# EAGLE design GCDuino3v3 (EAGLE 6.3)
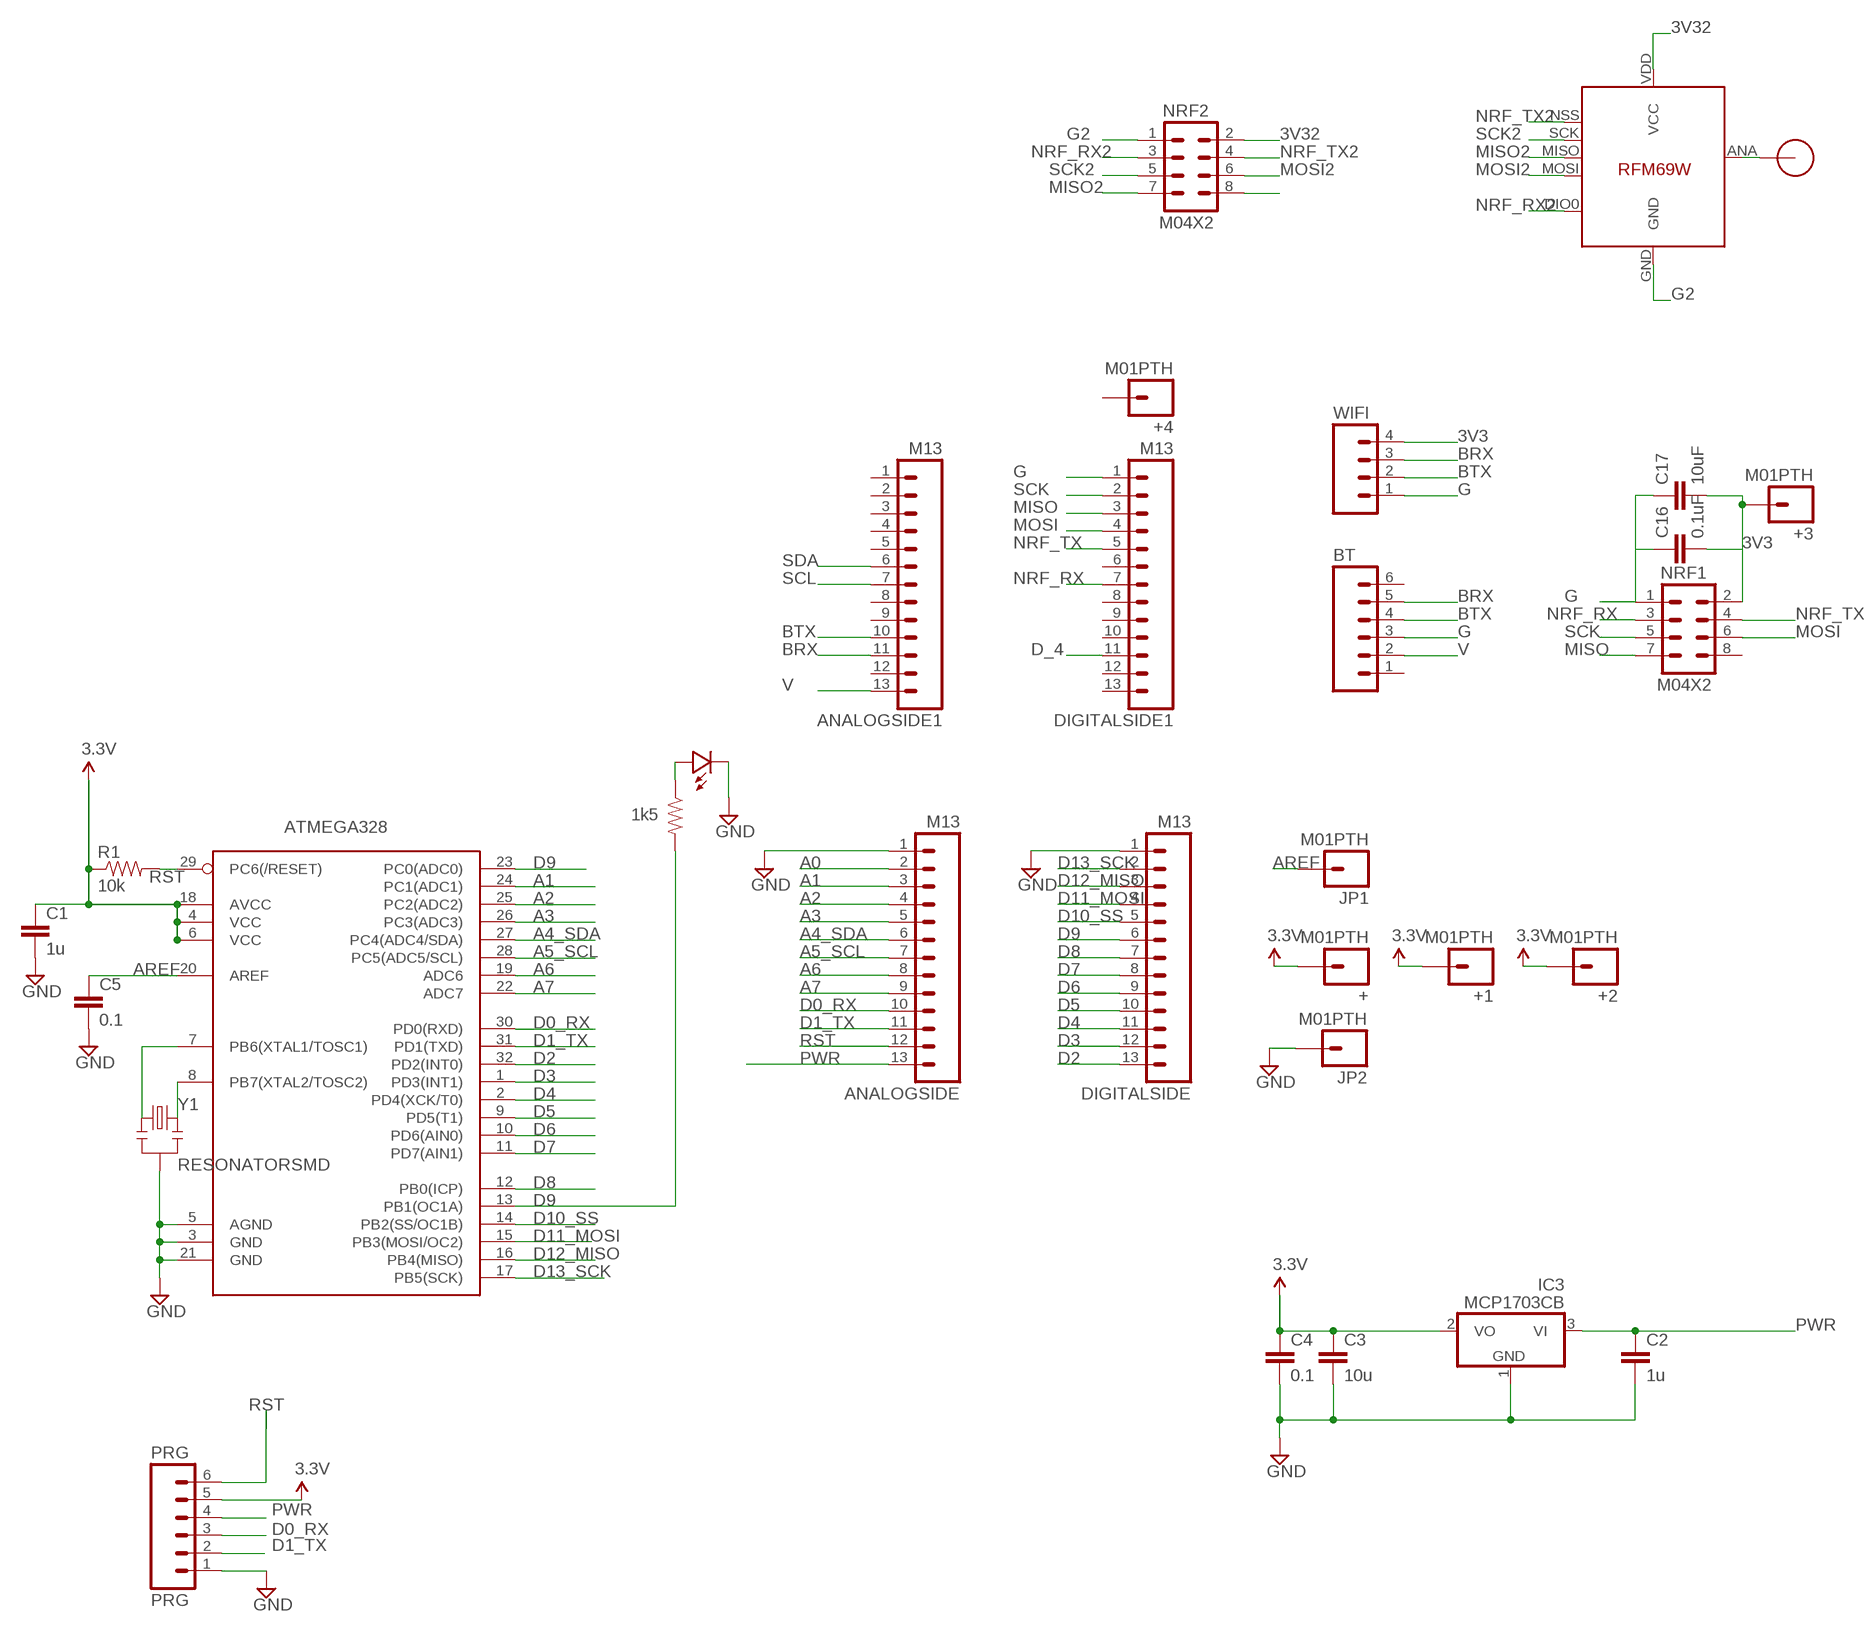
[diagram p0: schematic, sheet 1]

## Parts
+  M01PTH  [1X01]
+1  M01PTH  [1X01]
+2  M01PTH  [1X01]
+3  M01PTH  [1X01]
+4  M01PTH  [1X01]
ANALOGSIDE  M13  [1X13]
ANALOGSIDE1  M13  [1X13]
ATMEGA328  ATMega-328  ATMEGA168/328TQFP32  [TQFP32-08]
BT  M06SIP  [1X06]
C1  1u  CAP0805  [0805]
C2  1u  CAP0805  [0805]
C3  10u  CAP0805-CAP  [0805-CAP]
C4  0.1  CAP0805  [0805]
C5  0.1  CAP0805  [0805]
C16  0.1uF  CAP0805  [0805]
C17  10uF  CAP0805  [0805]
DIGITALSIDE  M13  [1X13]
DIGITALSIDE1  M13  [1X13]
IC3  MCP1703CB  [SOT23]
JP1  M01PTH  [1X01]
JP2  M01PTH  [1X01]
NRF1  M04X2  [2X4]
NRF2  M04X2  [2X4]
PRG  PRG  M06SIP  [1X06]
R1  10k  RESISTOR0805  [0805]
R2  1k5  RESISTOR0805  [0805]
U$2  LED0805  [0805-LED]
U$5  RFM69  [RFM69W-MINPADS]
U$8  RFM12B_ANTENNA  [RFM12B-ANTENNA]
WIFI  M04PTH  [1X04]
Y1  RESONATORSMD  [RESONATOR-SMD]

## Nets
3.3V: +1.1 +2.1 +.1 ATMEGA328.4(VCC) ATMEGA328.6(VCC) ATMEGA328.18(AVCC) C1.1 C3.1 C4.1 IC3.2(VO) PRG.5 R1.1
3V3: +3.1 C16.2 C17.2 NRF1.2 WIFI.4
3V32: NRF2.2 U$5.VDD(VCC)
A0: ANALOGSIDE.2 ATMEGA328.23(PC0(ADC0))
A1: ANALOGSIDE.3 ATMEGA328.24(PC1(ADC1))
A2: ANALOGSIDE.4 ATMEGA328.25(PC2(ADC2))
A3: ANALOGSIDE.5 ATMEGA328.26(PC3(ADC3))
A4_SDA: ANALOGSIDE.6 ATMEGA328.27(PC4(ADC4/SDA))
A5_SCL: ANALOGSIDE.7 ATMEGA328.28(PC5(ADC5/SCL))
A6: ANALOGSIDE.8 ATMEGA328.19(ADC6)
A7: ANALOGSIDE.9 ATMEGA328.22(ADC7)
AREF: ATMEGA328.20(AREF) C5.1 JP1.1
BRX: ANALOGSIDE1.11 BT.5 WIFI.3
BTX: ANALOGSIDE1.10 BT.4 WIFI.2
D0_RX: ANALOGSIDE.10 ATMEGA328.30(PD0(RXD)) PRG.3
D1_TX: ANALOGSIDE.11 ATMEGA328.31(PD1(TXD)) PRG.2
D2: ATMEGA328.32(PD2(INT0)) DIGITALSIDE.13
D3: ATMEGA328.1(PD3(INT1)) DIGITALSIDE.12
D4: ATMEGA328.2(PD4(XCK/T0)) DIGITALSIDE.11
D5: ATMEGA328.9(PD5(T1)) DIGITALSIDE.10
D6: ATMEGA328.10(PD6(AIN0)) DIGITALSIDE.9
D7: ATMEGA328.11(PD7(AIN1)) DIGITALSIDE.8
D8: ATMEGA328.12(PB0(ICP)) DIGITALSIDE.7
D9: ATMEGA328.13(PB1(OC1A)) DIGITALSIDE.6 R2.2
D10_SS: ATMEGA328.14(PB2(SS/OC1B)) DIGITALSIDE.5
D11_MOSI: ATMEGA328.15(PB3(MOSI/OC2)) DIGITALSIDE.4
D12_MISO: ATMEGA328.16(PB4(MISO)) DIGITALSIDE.3
D13_SCK: ATMEGA328.17(PB5(SCK)) DIGITALSIDE.2
D_4: DIGITALSIDE1.11
G: BT.3 C16.1 C17.1 DIGITALSIDE1.1 NRF1.1 WIFI.1
G2: NRF2.1 U$5.GND
GND [power]: ANALOGSIDE.1 ATMEGA328.3(GND) ATMEGA328.5(AGND) ATMEGA328.21(GND) C1.2 C2.2 C3.2 C4.2 C5.2 DIGITALSIDE.1 IC3.1(GND) JP2.1 PRG.1 U$2.MINUS Y1.2
MISO: DIGITALSIDE1.3 NRF1.7
MISO2: NRF2.7 U$5.MISO
MOSI: DIGITALSIDE1.4 NRF1.6
MOSI2: NRF2.6 U$5.MOSI
N$1: ATMEGA328.7(PB6(XTAL1/TOSC1)) Y1.1
N$2: R2.1 U$2.PLUS
N$3: U$5.ANA(ANT) U$8.P$1
N$4: NRF2.8
N$21: ATMEGA328.8(PB7(XTAL2/TOSC2)) Y1.3
NRF_RX: DIGITALSIDE1.7 NRF1.3
NRF_RX2: NRF2.3 U$5.DIO0
NRF_TX: DIGITALSIDE1.5 NRF1.4
NRF_TX2: NRF2.4 U$5.NSS(SEL)
PWR [power]: ANALOGSIDE.13 C2.1 IC3.3(VI) PRG.4
RST: ANALOGSIDE.12 ATMEGA328.29(PC6(/RESET)) PRG.6 R1.2
SCK: DIGITALSIDE1.2 NRF1.5
SCK2: NRF2.5 U$5.SCK
SCL: ANALOGSIDE1.7
SDA: ANALOGSIDE1.6
V: ANALOGSIDE1.13 BT.2
Unconnected: +4.1 ANALOGSIDE1.1 ANALOGSIDE1.2 ANALOGSIDE1.3 ANALOGSIDE1.4 ANALOGSIDE1.5 ANALOGSIDE1.8 ANALOGSIDE1.9 ANALOGSIDE1.12 BT.1 BT.6 DIGITALSIDE1.6 DIGITALSIDE1.8 DIGITALSIDE1.9 DIGITALSIDE1.10 DIGITALSIDE1.12 DIGITALSIDE1.13 NRF1.8

## Library data of the parts
+ +1-+4 JP1 JP2 = SparkFun-Connectors:M01: Header 1 Standard 1-pin 0.1" header. Use with straight break away headers (SKU : PRT-00116), right angle break away headers (PRT-00553), swiss pins (PRT-00743), machine pins (PRT-00117), and female headers (PRT-00115).
ANALOGSIDE ANALOGSIDE1 DIGITALSIDE DIGITALSIDE1 = SparkFun-Connectors:M13: 13-pin single row .1" header
ATMEGA328 = LowPowerLab:ATMEGA168/328: Atmel 32-pin 8-bit micro, 16k flash.
BT PRG = SparkFun-Connectors:M06: Header 6 Standard 6-pin 0.1" header. Use with straight break away headers (SKU : PRT-00116), right angle break away headers (PRT-00553), swiss pins (PRT-00743), machine pins (PRT-00117), and female headers (PRT-00115). Molex polarized connector foot print use with SKU : PRT-08094 with associated crimp pins and housings. NOTES ON THE VARIANTS LOCK and LOCK_LONGPADS... This footprint was designed to help hold the alignment of a through-hole component (i.e. 6-pin header) while soldering it into place. You may notice that each hole has been shifted either up or down by 0.005 of an inch from it's more standard position (which is a perfectly straight line). This slight alteration caused the pins (the squares in the middle) to touch the edges of the holes. Because they are alternating, it causes a "brace" to hold the component in place. 0.005 has proven to be the perfect amount of "off-center" position when using our standard breakaway headers. Although looks a little odd when you look at the bare footprint, once you have a header in there, the alteration is very hard to notice. Also, if you push a header all the way into place, it is covered up entirely on the bottom side. This idea of altering the position of holes to aid alignment will be further integrated into the Sparkfun Library for other footprints. It can help hold any component with 3 or more connection pins.
C1-C5 = LowPowerLab:CAP: Capacitor Standard 0603 ceramic capacitor, and 0.1" leaded capacitor.
C16 C17 = SparkFun-Capacitors:CAP: Capacitor Standard 0603 ceramic capacitor, and 0.1" leaded capacitor.
IC3 = linear:MCP1703: 250 mA, 16V, Low Quiescent Current LDO Regulator Source: http://ww1.microchip.com/downloads/en/DeviceDoc/22049b.pdf
NRF1 NRF2 = SparkFun-Connectors:M04X2: .1" header, two rows of four.
R1 R2 = LowPowerLab:RESISTOR: Resistor Basic schematic elements and footprints for 0603, 1206, and PTH resistors.
U$2 = LowPowerLab:LED
U$5 = LowPowerLab:RFM69
U$8 = LowPowerLab:RFM12B_ANTENNA
WIFI = SparkFun-Connectors:M04: Header 4 Standard 4-pin 0.1" header. Use with straight break away headers (SKU : PRT-00116), right angle break away headers (PRT-00553), swiss pins (PRT-00743), machine pins (PRT-00117), and female headers (PRT-00115). Molex polarized connector foot print use with SKU : PRT-08231 with associated crimp pins and housings. 1MM SMD Version SKU: PRT-10208
Y1 = SparkFun-FreqCtrl:RESONATOR: Resonator Small SMD resonator. This is the itty bitty 10/20MHz resonators with built in caps. CSTCE10M0G55 and CSTCE20M0V53. Footprint has been reviewed closely but hasn't been tested yet.

## Net classes
1 power: width 0.381 mm, clearance 0.254 mm

## Board
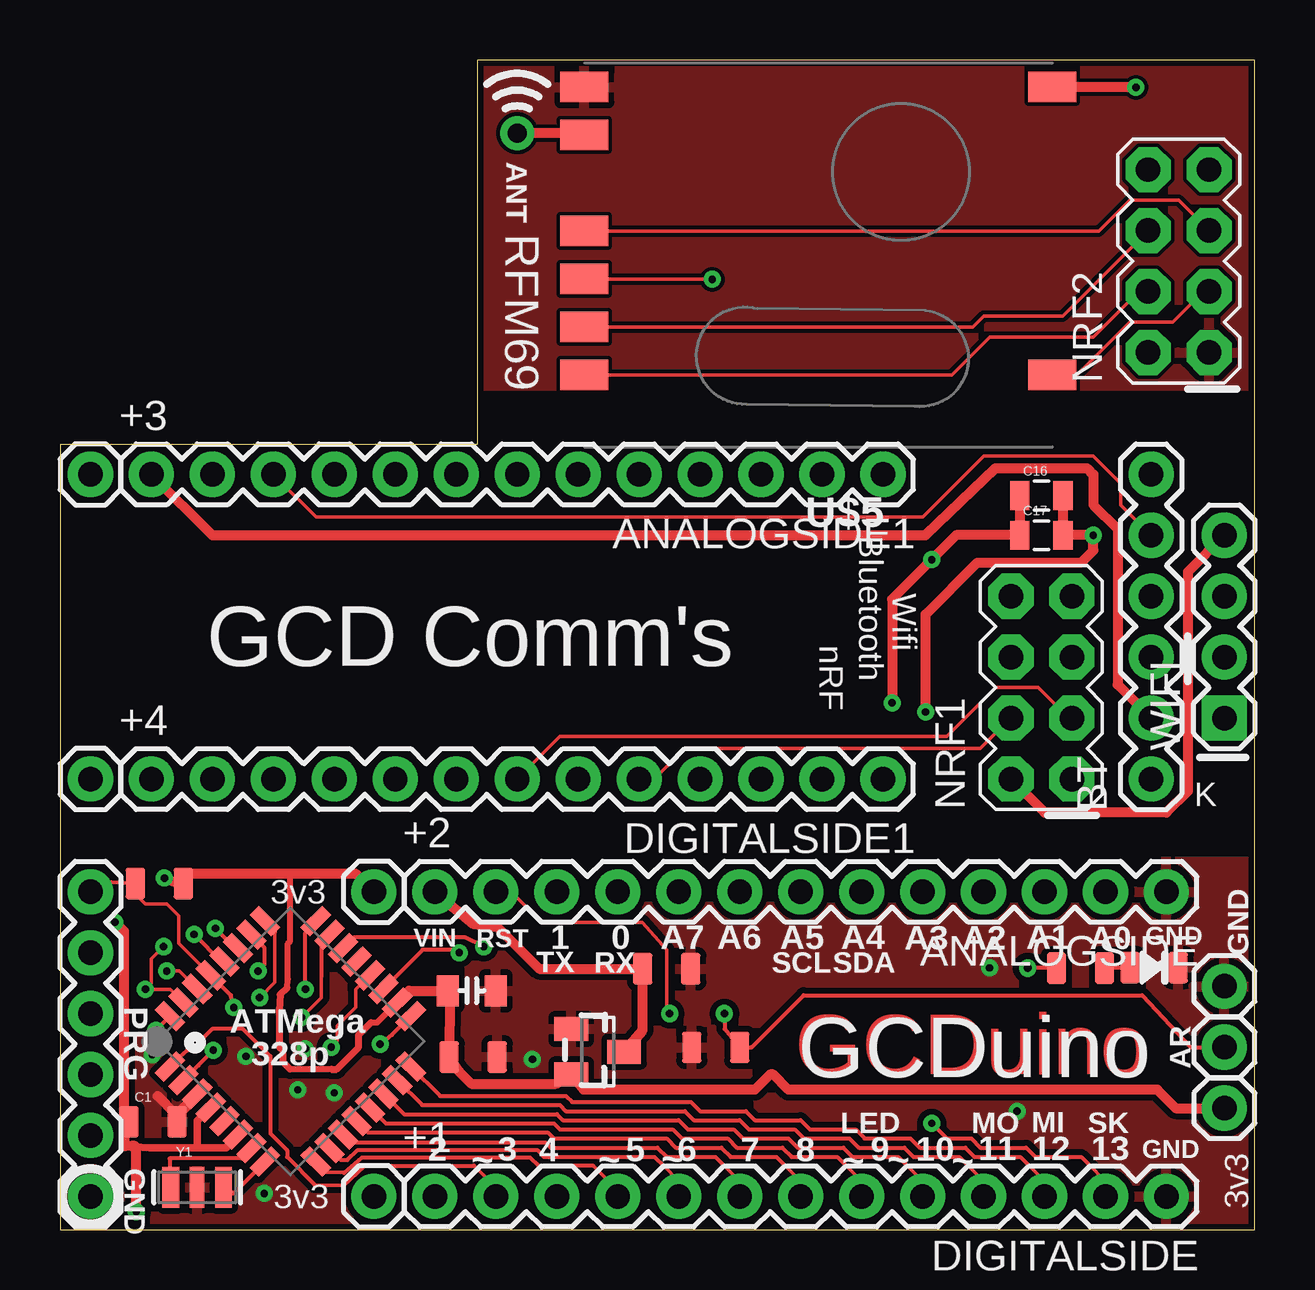
[diagram p1: board, top side]
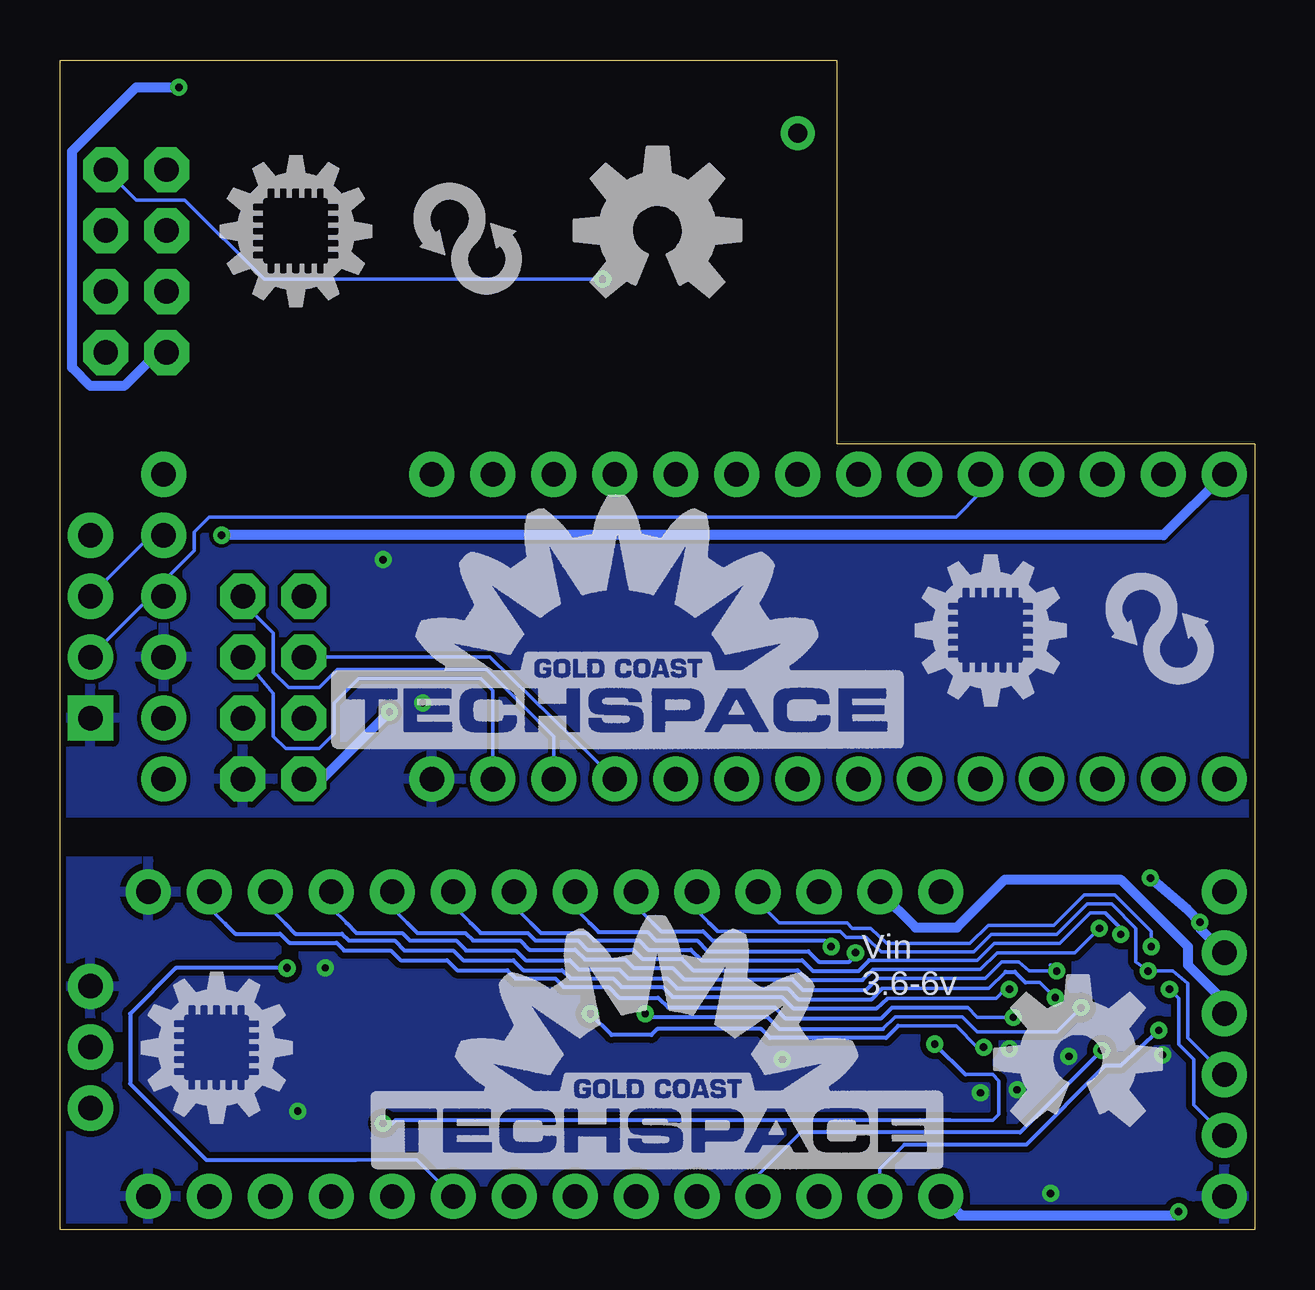
[diagram p2: board, bottom side, seen from below]

Size 49.78 x 48.77 mm. Coordinates in mm from the lower left corner, seen from the top.
Outline: 0,0 49.78,0 49.78,48.77 17.4,48.77 17.4,32.77 0,32.77 0,0
Copper layers (1*16): Top 0.035mm / dielectric 1.5mm / Bottom 0.035mm
Design rules "DFRobot_Eagle_Rule_v0.4": minimum track width 6mil, minimum drill 12mil, track to track 6mil, track to pad 6mil, pad to pad 6mil, via to via 6mil, smd to smd 0mil, copper to edge 10mil, drill to drill 10mil, minimum pad ring 12mil, minimum via ring 8mil, stop-mask expansion 2mil, vias tented up to drill 25mil, thermal gap 10mil

### Footprints (pad centres in the part's own frame; a part is rotated, then mirrored left to right if it is on the bottom)
1X01 = drill 1.016 pad 1.88: 1 0,0
1X13 = drill 1.016 pad 1.88: 1 0,0; 2 2.54,0; 3 5.08,0; 4 7.62,0; 5 10.16,0; 6 12.7,0; 7 15.24,0; 8 17.78,0; 9 20.32,0; 10 22.86,0; 11 25.4,0; 12 27.94,0; 13 30.48,0
TQFP32-08 = smd 1.27 x 0.533: 1 -4.293,2.8; 2 -4.293,2; 3 -4.293,1.2; 4 -4.293,0.4; 5 -4.293,-0.4; 6 -4.293,-1.2; 7 -4.293,-2; 8 -4.293,-2.8; 17 4.293,-2.8; 18 4.293,-2; 19 4.293,-1.2; 20 4.293,-0.4; 21 4.293,0.4; 22 4.293,1.2; 23 4.293,2; 24 4.293,2.8 | smd 0.533 x 1.27: 9 -2.8,-4.293; 10 -2,-4.293; 11 -1.2,-4.293; 12 -0.4,-4.293; 13 0.4,-4.293; 14 1.2,-4.293; 15 2,-4.293; 16 2.8,-4.293; 25 2.8,4.293; 26 2,4.293; 27 1.2,4.293; 28 0.4,4.293; 29 -0.4,4.293; 30 -1.2,4.293; 31 -2,4.293; 32 -2.8,4.293
1X06 = drill 1.016 pad 1.88: 1 0,0; 2 2.54,0; 3 5.08,0; 4 7.62,0; 5 10.16,0; 6 12.7,0
0805 = smd 0.8 x 1.3: 1 -1,0; 2 1,0
0805-CAP = smd 0.902 x 1.3: 1 -1,0; 2 1,0
0805' = smd 0.8 x 1.2: 1 -0.9,0; 2 0.9,0
SOT23 = smd 1 x 1.4: 1 -0.95,-1.1; 2 0.95,-1.1; 3 0,1.1
2X4 = drill 1.016 pad 1.88 octagon: 1 -3.81,-1.27; 2 -3.81,1.27; 3 -1.27,-1.27; 4 -1.27,1.27; 5 1.27,-1.27; 6 1.27,1.27; 7 3.81,-1.27; 8 3.81,1.27
0805-LED = smd 0.8 x 1.3: MINUS -1,0; PLUS 1,0
RFM69W-MINPADS = smd 2 x 1.27: ANA 8,-5; DIO0 -11.5,5; GND 8,-7; MISO 8,1; MOSI 8,3; NSS 8,5; SCK 8,-1; VDD -11.5,-7
RFM12B-ANTENNA = drill 0.8 pad 1.422: P$1 0,0
1X04 = drill 1.016 pad 1.88 square: 1 0,0 | drill 1.016 pad 1.88: 2 2.54,0; 3 5.08,0; 4 7.62,0
RESONATOR-SMD = smd 0.7 x 1.7: 1 -1.1,0; 3 1.1,0 | smd 0.6 x 1.7: 2 0,0

### Placement (x,y rotation side)
+  48.51,5.08 270 top
+1  13.08,1.4 0 top
+2  13.08,14.1 0 top
+3  1.27,31.5 0 top
+4  1.27,18.8 0 top
ANALOGSIDE  46.1,14.1 180 top
ANALOGSIDE1  34.29,31.5 180 top
ATMEGA328  9.6,7.86 45 top
BT  45.47,18.8 90 top
C1  3.87,4.51 0 top
C2  25.27,10.89 0 top
C3  17.16,9.97 0 top
C4  17.21,7.21 0 top
C5  27.32,7.61 180 top
C16  0.1uF  [0805']  40.89,30.61 0 top
C17  10uF  [0805']  40.89,28.96 0 top
DIGITALSIDE  46.1,1.4 180 top
DIGITALSIDE1  34.29,18.8 180 top
IC3  22.4,7.43 270 top
JP1  48.51,7.62 0 top
JP2  48.51,10.16 0 top
NRF1  40.89,22.61 90 top
NRF2  46.61,40.39 90 top
PRG  1.27,1.4 90 top
R1  4.14,14.44 180 top
R2  42.52,10.92 180 top
U$1  [ID_LOGO_X0.25]  14.22,21.72 0 bottom
U$2  45.59,10.94 180 top
U$3  [REFACTORLOOP]  3.68,25.27 0 bottom
U$4  [GCTS_X0.5_TSILK]  38.48,19.94 0 bottom
U$5  29.84,40.64 180 top
U$6  [ID_LOGO_X0.25]  46.48,4.32 0 bottom
U$7  [OSHW-LOGO-L]  7.37,7.11 0 bottom
U$8  19.05,45.72 0 top
U$9  [GCTS_X0.5_TSILK]  36.83,2.41 0 bottom
U$10  [ID_LOGO_X0.25]  43.18,38.35 0 bottom
U$11  [OSHW-LOGO-L]  24.89,41.66 0 bottom
U$12  [REFACTORLOOP]  32.51,41.53 0 bottom
WIFI  48.51,21.34 90 top
Y1  5.71,1.78 0 top

### Tracks (layer width: path | path; a pad name or v marks a point on that pad's centre or on a via)
3.3V  (via drill 0.3, 0.3 pad 0.25)
  Top 0.254: 14.54,9.97 14.22,9.65 | ATMEGA328.18 13.2,8.64 12.95,8.64 | 11.3,6.7 9.59,6.7 | 9.46,10.1 9.49,10.45 9.49,11.94 9.59,12.03 9.59,14.86
  Top 0.3: 12.95,8.64 12.45,8.13 12.45,7.62 11.53,6.7 11.3,6.7 | 9.46,10.1 9.18,9.81 9.14,9.14 9.14,7.62 9.27,7.49 9.27,7.02 9.59,6.7
  Top 0.305: 2.73,3.49 3.75,3.43 5.71,3.43 | 5.71,3.43 5.71,4.54 ATMEGA328.4 | 5.71,3.43 6.93,3.43 6.96,3.49 7.41,3.95 ATMEGA328.6
  Top 0.406: v2.29,12.83 2.67,12.45 2.67,4.45 | v4.35,14.67 5.01,14.41 R1.1 5.14,14.53 5.47,14.86 9.59,14.86 12.32,14.86 +2.1 | 2.67,4.45 2.67,3.56 2.73,3.49 2.98,3.5 3.12,3.5 3.17,3.44 v3.17,0.76 | 14.54,9.97 C3.1 16.24,9.76 C4.1 16.62,6.62 17.14,6.1 20.66,6.1 IC3.2 21.81,5.84 28.96,5.84 29.59,6.48 29.72,6.48 30.35,5.84 45.72,5.84 46.48,5.08 +.1 | 2.67,4.45 2.73,4.51 C1.1 | ATMEGA328.18 14.22,9.65
  Bottom 0.406: v4.35,14.67 2.79,13.34 v2.29,12.83 2.29,12.57 PRG.5 | +1.1 12.26,0.6 3.37,0.6 v3.17,0.76
3V3  (via drill 0.3)
  Top 0.406: C16.2 C17.2 v43.05,28.96 43.05,28.32 42.55,27.81 38.23,27.81 36.07,25.65 v36.07,21.59 | WIFI.4 46.99,27.43 46.99,18.29 46.1,17.4 41.02,17.4 NRF1.2
  Bottom 0.406: +3.1 3.81,28.96 v43.05,28.96 | NRF1.2 38.86,18.8 v36.07,21.59
3V32  (via drill 0.3)
  Top 0.406: v44.83,47.62 44.82,47.64 U$5.VDD
  Bottom 0.406: NRF2.2 45.72,36.58 47.12,35.18 48.51,35.18 49.28,35.94 49.28,44.96 46.61,47.62 v44.83,47.62
A0  (via drill 0.3)
  Top 0.152: 10.89,10.57 10.89,9.68 v10.06,8.86
  Top 0.16: 10.89,10.57 10.89,12.16 11.04,12.31 ATMEGA328.23
  Bottom 0.152: 42.89,12.76 43.56,13.43 ANALOGSIDE.2 | 11.97,9.27 11.56,8.86 v10.06,8.86
  Bottom 0.16: 42.89,12.76 42.48,12.35 40.61,12.35 40.23,11.97 38.26,11.97 37.94,11.65 36.01,11.65 35.59,11.24 33.66,11.24 33.24,10.83 31.15,10.83 30.8,10.48 29.15,10.48 28.8,10.13 26.92,10.13 26.48,9.68 24.86,9.68 24.45,9.27 20,9.27 19.56,8.83 15.56,8.83 15.11,9.27 11.97,9.27
A1  (via drill 0.3)
  Top 0.16: ATMEGA328.24 10.22,12.38 v10.22,10.03
  Bottom 0.152: 15.3,9.65 10.76,9.65 10.41,10.03 | 40.39,12.76 41.02,13.4 ANALOGSIDE.3
  Bottom 0.16: 40.39,12.76 39.97,12.35 38.04,12.35 37.75,12.06 35.85,12.06 35.43,11.65 33.4,11.65 32.99,11.24 30.89,11.24 30.48,10.83 28.86,10.83 28.51,10.48 26.73,10.48 26.38,10.13 24.67,10.13 24.26,9.72 19.72,9.72 19.24,9.24 15.75,9.24 15.3,9.65 | 10.41,10.03 v10.22,10.03
A2  (via drill 0.3)
  Top 0.152: 8.95,12.4 8.95,10.32 v8.32,9.68
  Top 0.16: 8.95,12.4 ATMEGA328.25
  Bottom 0.152: 15.53,10.06 11.08,10.06 10.38,10.76 | 37.85,12.79 38.48,13.43 ANALOGSIDE.4 | 9.56,10.32 8.95,10.32 v8.32,9.68
  Bottom 0.16: 37.85,12.79 37.43,12.38 35.53,12.38 35.21,12.06 33.27,12.06 32.86,11.65 30.8,11.65 30.39,11.24 28.54,11.24 28.16,10.86 26.48,10.86 26.1,10.48 24.48,10.48 24.07,10.06 19.46,10.06 19.02,9.62 15.97,9.62 15.53,10.06 | 10.38,10.76 10,10.76 9.56,10.32
A3  (via drill 0.3)
  Top 0.16: ATMEGA328.26 8.51,11.78 8.51,11.05 v8.26,10.79
  Bottom 0.152: 15.72,10.48 11.24,10.48 10.54,11.18 9.84,11.18 9.4,10.79 v8.26,10.79 | 35.31,12.79 35.94,13.43 ANALOGSIDE.5
  Bottom 0.16: 35.31,12.79 34.89,12.38 32.89,12.38 32.58,12.06 30.61,12.06 30.23,11.68 28.32,11.68 27.91,11.27 26.23,11.27 25.88,10.92 24.26,10.92 23.78,10.45 19.27,10.45 18.83,10 16.19,10 15.72,10.48 | v8.26,10.79 8.51,11.05
A4_SDA  (via drill 0.3)
  Top 0.16: v6.48,12.57 7.3,11.74 ATMEGA328.27
  Bottom 0.152: 15.91,10.86 11.43,10.86 10.73,11.56 7.49,11.56 v6.48,12.57 | 32.67,12.79 33.4,13.53 ANALOGSIDE.6
  Bottom 0.16: 32.67,12.79 32.26,12.38 30.29,12.38 29.97,12.06 28.19,12.06 27.81,11.68 25.91,11.68 25.53,11.3 23.88,11.3 23.4,10.83 19.05,10.83 18.64,10.41 16.35,10.41 15.91,10.86
A5_SCL  (via drill 0.3)
  Top 0.16: v5.59,12.32 6.73,11.18 ATMEGA328.28
  Bottom 0.152: 16.07,11.24 11.56,11.24 10.86,11.94 8.13,11.94 6.86,13.21 6.22,13.21 | 30.16,12.79 30.86,13.49 ANALOGSIDE.7
  Bottom 0.16: 30.16,12.79 29.75,12.38 27.84,12.38 27.53,12.06 25.65,12.06 25.27,11.68 23.5,11.68 23.05,11.24 18.86,11.24 18.41,10.79 16.51,10.79 16.07,11.24 | 6.22,13.21 5.59,12.57 v5.59,12.32
A6  (via drill 0.3)
  Top 0.16: v16.64,11.56 16.51,11.68 15.11,11.68 ATMEGA328.19
  Bottom 0.152: 27.72,12.79 28.32,13.4 ANALOGSIDE.8
  Bottom 0.16: 27.72,12.79 27.34,12.41 25.3,12.41 24.96,12.06 23.24,12.06 22.8,11.62 18.61,11.62 18.16,11.18 16.89,11.18 16.64,11.43 v16.64,11.56
A7  (via drill 0.3)
  Top 0.16: v17.65,11.81 16.89,12.19 12.23,12.19 ATMEGA328.22 12.11,12.06
  Bottom 0.152: 25.08,12.79 25.78,13.49 ANALOGSIDE.9
  Bottom 0.16: 25.08,12.79 24.73,12.45 22.99,12.45 22.61,12.06 17.91,12.06 v17.65,11.81
AREF  (via drill 0.3)
  Top 0.152: 12.9,10.61 12.32,10.03 12.32,9.27 11.56,8.51 11.56,7.87 v11.3,7.62
  Top 0.16: ATMEGA328.20 12.9,10.61 | v27.69,9.02 27.69,8.38 C5.1 28.82,7.61 30.99,9.78 45.09,9.78 47.12,7.62 JP1.1 | JP1.1
  Bottom 0.152: 14.86,8.51 12.45,8.51 11.56,7.62 v11.3,7.62
  Bottom 0.16: 14.86,8.51 15.37,8 20.19,8 20.57,8.38 24.89,8.38 25.15,8.13 26.8,8.13 v27.69,9.02
BRX
  Top 0.152: ANALOGSIDE1.11 10.67,29.72 35.94,29.72 38.48,32.26 43.05,32.26 44.2,31.11 44.2,30.23 BT.5
  Bottom 0.152: WIFI.3 45.97,28.96 BT.5
BTX
  Bottom 0.152: ANALOGSIDE1.10 11.43,30.73 12.45,29.72 43.56,29.72 44.2,29.08 44.2,28.32 45.47,27.05 BT.4 45.97,26.42 WIFI.2
D0_RX  (via drill 0.3)
  Top 0.152: v4.45,10.79 4.97,10.79 ATMEGA328.30
  Bottom 0.152: 22.73,12.79 23.24,13.3 ANALOGSIDE.10 | PRG.3 2.79,8 2.79,10.29 3.43,10.79 v4.45,10.79 4.95,11.18 4.95,12.57 5.97,13.59 6.99,13.59 8.26,12.32 10.99,12.32 11.72,11.59 15.56,11.59 16.19,12.19 17.02,12.19 17.27,12.45 22.38,12.45
  Bottom 0.16: 22.73,12.79 22.38,12.45
D1_TX  (via drill 0.3)
  Top 0.152: ATMEGA328.31 4.6,10.03 v3.56,10.03 3.81,10.29 3.81,11.3 v4.32,11.81
  Bottom 0.152: ANALOGSIDE.11 20.7,13.68 19.81,12.79 16.99,12.79 16.76,12.57 16,12.57 15.34,11.94 11.87,11.94 11.11,12.7 8.38,12.7 7.11,13.97 5.84,13.97 4.32,12.45 v4.32,11.81 | v3.56,10.03 3.17,9.65 3.17,7.75 2.54,7.11 2.54,5.21 PRG.2
D2  (via drill 0.3)
  Top 0.16: ATMEGA328.32 v4,8.33 v4,8.32
  Bottom 0.152: 14.61,3.56 15.62,2.54 DIGITALSIDE.13
  Bottom 0.16: 14.61,3.56 9.53,3.56 6.22,6.86 5.59,6.86 v4,8.32
D3
  Top 0.152: 17.25,2.68 18.16,1.77 DIGITALSIDE.12
  Top 0.16: ATMEGA328.1 5.02,7.24 5.3,7.49 5.46,7.49 6.35,8.38 7.62,8.38 8.76,7.24 8.76,4.02 9.46,3.32 9.46,3.04 10.61,1.88 11.81,1.87 12.69,2.68 17.25,2.68
D4  (via drill 0.3)
  Top 0.16: ATMEGA328.2 5.77,6.86 v6.38,7.49
  Bottom 0.152: 18.92,4.06 20.7,2.29 DIGITALSIDE.11
  Bottom 0.16: v6.38,7.49 9.78,4.06 18.92,4.06
D5
  Top 0.152: 22.23,2.67 23.24,1.65 DIGITALSIDE.10
  Top 0.16: 22.23,2.67 19.94,2.67 19.59,3.02 12.57,3.02 11.84,2.38 11.09,2.41 ATMEGA328.9
  Top 0.254: ATMEGA328.9 10.96,2.54
D6
  Top 0.152: 25.15,2.67 25.78,2.03 DIGITALSIDE.9
  Top 0.16: 25.15,2.67 24.77,3.05 20.16,3.05 19.88,3.33 12.41,3.33 11.97,2.92 11.71,2.92 ATMEGA328.10
D7
  Top 0.152: 27.69,2.67 28.32,2.03 DIGITALSIDE.8
  Top 0.16: ATMEGA328.11 12.11,3.65 20.23,3.65 20.45,3.43 24.89,3.43 25.27,3.05 27.3,3.05 27.69,2.67
D8
  Top 0.152: 30.23,2.67 30.86,2.03 DIGITALSIDE.7
  Top 0.16: 30.23,2.67 29.84,3.05 27.94,3.05 27.56,3.43 25.65,3.43 25.27,3.81 20.57,3.81 20.32,4.06 12.83,4.06 ATMEGA328.12
D9  (via drill 0.32)
  Top 0.152: 32.77,2.67 33.4,2.03 DIGITALSIDE.6
  Top 0.16: 32.77,2.67 32.38,3.05 30.48,3.05 30.1,3.43 28.19,3.43 27.81,3.81 25.91,3.81 25.53,4.19 20.83,4.19 20.57,4.45 13.58,4.45 ATMEGA328.13 | R2.2 v40.33,10.92 v40.32,10.92
  Bottom 0.152: 37.47,2.92 34.92,2.92 DIGITALSIDE.6
  Bottom 0.16: v40.32,10.92 44.96,10.92 46.86,9.02 46.86,6.1 43.69,2.92 37.47,2.92
D10_SS
  Top 0.152: 35.31,2.67 35.94,2.03 DIGITALSIDE.5
  Top 0.16: 35.31,2.67 34.92,3.05 33.02,3.05 32.64,3.43 30.73,3.43 30.35,3.81 28.45,3.81 28.07,4.19 26.16,4.19 25.78,4.57 20.95,4.57 20.7,4.83 14.33,4.83 ATMEGA328.14
D11_MOSI
  Top 0.152: 37.85,2.67 38.48,2.03 DIGITALSIDE.4
  Top 0.16: 37.85,2.67 37.47,3.05 35.56,3.05 35.18,3.43 33.27,3.43 32.89,3.81 30.99,3.81 30.61,4.19 28.7,4.19 28.32,4.57 26.42,4.57 26.04,4.95 21.08,4.95 20.83,5.21 15.08,5.21 ATMEGA328.15
D12_MISO
  Top 0.152: 40.39,2.67 41.02,2.03 DIGITALSIDE.3
  Top 0.16: 40.39,2.67 40.01,3.05 38.1,3.05 37.72,3.43 35.81,3.43 35.43,3.81 33.53,3.81 33.15,4.19 31.24,4.19 30.86,4.57 28.96,4.57 28.57,4.95 26.67,4.95 26.29,5.33 21.34,5.33 21.08,5.59 15.83,5.59 ATMEGA328.16
D13_SCK  (via drill 0.3)
  Top 0.152: 42.86,2.73 43.56,2.03 DIGITALSIDE.2
  Top 0.16: ATMEGA328.17 13.83,8.13 v13.34,7.75 | v36.32,4.45 36.96,3.81 37.97,3.81 38.35,3.43 40.26,3.43 40.64,3.05 42.55,3.05 42.86,2.73
  Bottom 0.152: 12.7,4.57 10.92,4.57 10.67,4.83 10.67,6.22 10.92,6.48 12.06,6.48
  Bottom 0.16: v13.34,7.75 12.06,6.48 | 12.7,4.57 35.81,4.57 35.94,4.45 v36.32,4.45
G  (via drill 0.3)
  Top 0.406: C16.1 C17.1 37.34,28.96 v36.32,27.94 34.67,26.29 v34.67,21.97
  Bottom 0.152: 48.01,21.34 WIFI.1
  pour Bottom (isolate 0.16): 0,32.77 49.78,32.64 49.78,17.4 0,17.4
G2
  pour Top (isolate 0.16): 17.4,48.77 49.78,48.77 49.78,35.18 17.4,35.18
GND  (via drill 0.3)
  Top 0.406: C1.2 4.72,4.68 ATMEGA328.3 5.72,5.59 4.83,4.7 4.83,4.83 4.06,5.59
  other vias: 11.43,5.71 9.91,5.84 39.88,4.95 10.22,7.56 7.75,7.24 3.84,7.3 38.73,10.92 19.68,7.11 8.51,1.52
  pour Top (isolate 0.16): 0,15.37 49.78,15.37 49.78,0 0,0
  pour Bottom (isolate 0.16): 0,15.37 49.78,15.37 49.78,0 0,0
MISO
  Bottom 0.152: NRF1.7 42.16,26.16 40.89,24.89 40.89,23.24 40.26,22.61 38.99,22.61 38.23,23.37 32,23.37 29.21,20.57 DIGITALSIDE1.3
MISO2  (via drill 0.3)
  Top 0.152: v27.18,39.62 27.16,39.64 U$5.MISO
  Bottom 0.152: NRF2.7 46.61,42.93 44.58,42.93 41.27,39.62 v27.18,39.62
MOSI
  Bottom 0.152: NRF1.6 31.88,23.88 DIGITALSIDE1.4
MOSI2
  Top 0.152: NRF2.6 41.78,38.1 38.48,38.1 38.02,37.64 U$5.MOSI
N$1
  Top 0.16: ATMEGA328.7 7.58,2.98 4.57,2.98 4.55,2.01
  Top 0.406: Y1.1 4.55,1.78 4.55,2.01
N$2
  Top 0.16: R2.1 43.39,10.94 U$2.PLUS
N$3
  Top 0.406: U$5.ANA 21.77,45.72 U$8.P$1
N$21
  Top 0.16: ATMEGA328.8 7.21,1.51 6.94,1.78 Y1.3
NRF_RX
  Top 0.152: NRF1.3 41.78,21.59 40.77,22.61 38.99,22.61 36.96,20.57 20.83,20.57 DIGITALSIDE1.7
NRF_RX2
  Top 0.152: NRF2.3 47.62,39.12 46.35,37.85 44.58,37.85 42.37,35.64 U$5.DIO0
NRF_TX
  Top 0.152: DIGITALSIDE1.5 24.77,18.8 26.04,20.07 38.35,20.07 NRF1.4
NRF_TX2
  Top 0.152: NRF2.4 44.96,39.12 43.05,37.21 38.73,37.21 37.16,35.64 U$5.NSS
PWR
  Top 0.406: ANALOGSIDE.13 17.21,12.76 18.22,12.64 19.97,10.89 C2.1 24.27,8.33 IC3.3
  Bottom 0.406: ANALOGSIDE.13 14.13,12.61 12.41,12.61 10.41,14.61 5.59,14.61 2.79,11.81 2.79,11.05 1.27,9.53 PRG.4
RST  (via drill 0.3)
  Top 0.152: v25.4,9.02 25.27,9.14 25.27,11.68 24.26,12.83 20.07,12.83 18.8,14.1 ANALOGSIDE.12 | ATMEGA328.29 4.95,11.94 4.95,13.08 4.45,13.59 3.56,13.59 3.14,14.01 R1.2
  Top 0.16: v7.24,9.27 7.12,9.78 ATMEGA328.29 6.21,10.55 | PRG.6 1.68,14.5 R1.2 3.17,14.4
  Bottom 0.152: 15.49,8.38 14.99,8.89 12.19,8.89 11.56,8.26 8.26,8.26 v7.24,9.27
  Bottom 0.16: v25.4,9.02 25.27,8.89 20.32,8.89 19.81,8.38 15.49,8.38 | 7.24,9.14 v7.24,9.27
SCK
  Bottom 0.152: NRF1.5 40.89,22.35 40.89,20.57 40.39,20.07 38.99,20.07 38.35,20.7 38.35,21.97 37.34,22.99 32.26,22.99 31.75,22.48 DIGITALSIDE1.2
SCK2
  Top 0.152: NRF2.5 46.61,42.93 44.58,42.93 43.29,41.64 U$5.SCK
V
  Top 0.406: ANALOGSIDE1.13 6.35,28.96 36.07,28.96 38.99,31.75 42.8,31.75 43.05,31.5 43.05,30.23 44.07,29.21 44.07,22.73 BT.2

### Text on the board
Top: GCDuino
tPlace: ANT | RFM69 | Bluetooth | Wifi | nRF | GCD Comm's | K | 3v3 | GND | VIN | 1 | 0 | A7 | A6 | A5 | A4 | A3 | A2 | A1 | RST | TX | RX | A0 | GND | SCL | SDA | AR | ATMega | 328p | PRG | GCDuino | 2 | 3 | 4 | 5 | 6 | 7 | 8 | LED | 9 | 10 | MO | 11 | MI | 12 | SK | 13 | GND | GND | ~ | ~ | ~ | ~ | ~ | ~ | 3v3 | 3v3
bPlace: Vin / 3.6-6v
tDocu: REG
_bsilk: VIN | 3.3 | 1 | 0 | A7 | A6 | A5 | A4 | A3 | A2 | A1 | A0 | GND | ANT | DTR | GND | 3.3 | + | AREF | GND | 2 | 3 | 4 | 5 | 6 | 7 | 8 | 9 | 10 | 11 | 12 | 13 | RST